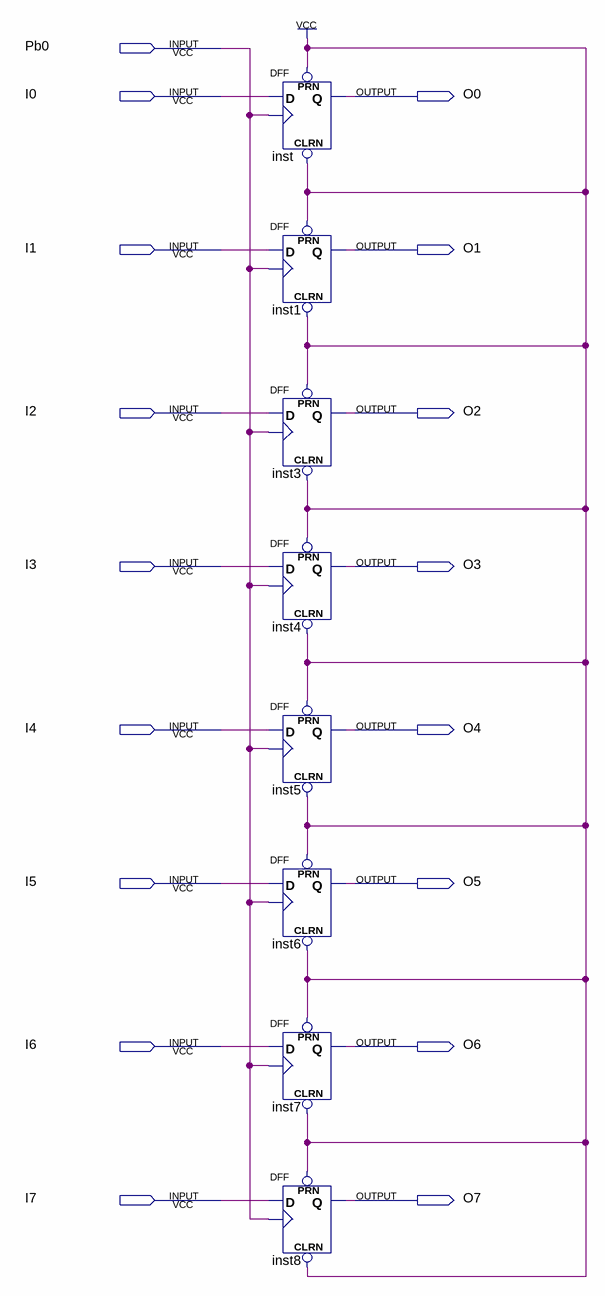
[diagram p0: schematic sheet]
// Quartus schematic pipo.bdf as structural Verilog: 8 symbols, 17 pins
module pipo (
  input  Pb0,
  input  I0,
  input  I1,
  input  I2,
  input  I3,
  input  I4,
  input  I5,
  input  I6,
  input  I7,
  output O0,
  output O1,
  output O2,
  output O3,
  output O4,
  output O5,
  output O6,
  output O7
);

  DFF inst (.CLRN(1'b1), .CLK(Pb0), .D(I0), .PRN(1'b1), .Q(O0));
  DFF inst1 (.CLRN(1'b1), .CLK(Pb0), .D(I1), .PRN(1'b1), .Q(O1));
  DFF inst3 (.CLRN(1'b1), .CLK(Pb0), .D(I2), .PRN(1'b1), .Q(O2));
  DFF inst4 (.CLRN(1'b1), .CLK(Pb0), .D(I3), .PRN(1'b1), .Q(O3));
  DFF inst5 (.CLRN(1'b1), .CLK(Pb0), .D(I4), .PRN(1'b1), .Q(O4));
  DFF inst6 (.CLRN(1'b1), .CLK(Pb0), .D(I5), .PRN(1'b1), .Q(O5));
  DFF inst7 (.CLRN(1'b1), .CLK(Pb0), .D(I6), .PRN(1'b1), .Q(O6));
  DFF inst8 (.CLRN(1'b1), .CLK(Pb0), .D(I7), .PRN(1'b1), .Q(O7));
endmodule
